# EAGLE design ES_Daisy_Pod_Rev5 (EAGLE 9.6.2)

## Sheet 1 of 2
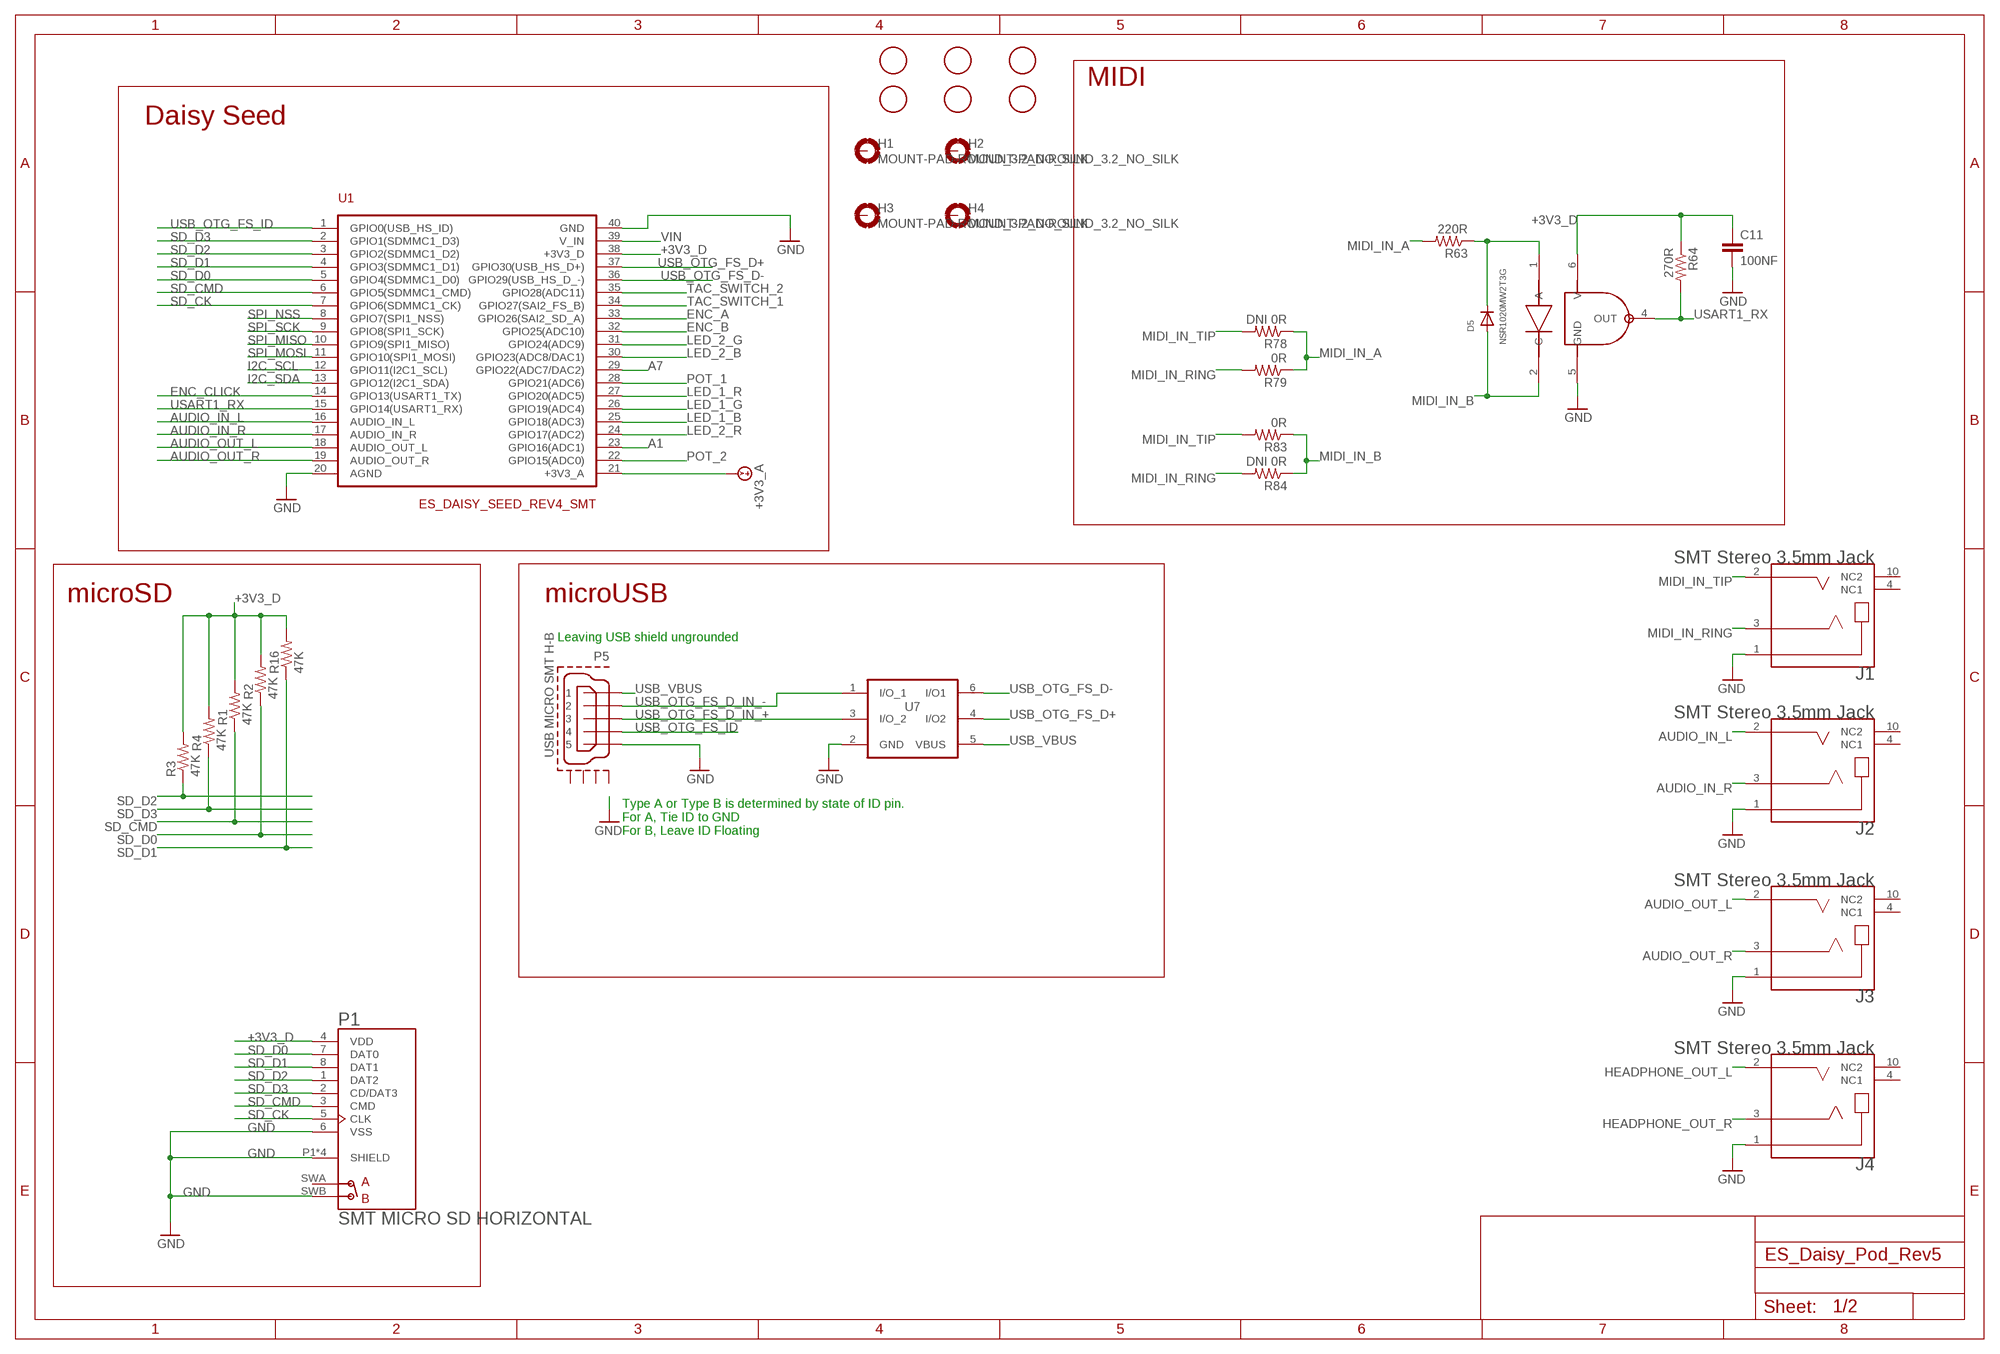
[diagram p0: schematic, sheet 1]

### Parts
C11  100NF  C-EUC0402  [C0402]
D5  NSR1020MW2T3G  DIODE_SOD-323F  [SOD-323F]
FD1  FIDUCIAL  [FIDUCIAL_1MM]
FD2  FIDUCIAL  [FIDUCIAL_1MM]
FD3  FIDUCIAL  [FIDUCIAL_1MM]
FD4  FIDUCIAL  [FIDUCIAL_1MM]
FD5  FIDUCIAL  [FIDUCIAL_1MM]
FD6  FIDUCIAL  [FIDUCIAL_1MM]
H1  MOUNT-PAD-ROUND_3.2_NO_SILK  [32-PAD_NO_SILK]
H2  MOUNT-PAD-ROUND_3.2_NO_SILK  [32-PAD_NO_SILK]
H3  MOUNT-PAD-ROUND_3.2_NO_SILK  [32-PAD_NO_SILK]
H4  MOUNT-PAD-ROUND_3.2_NO_SILK  [32-PAD_NO_SILK]
J1  SMT Stereo 3.5mm Jack  SJ2_TRS_JACK  [CUI_SJ2-35863B1-SMT-TR]
J2  SMT Stereo 3.5mm Jack  SJ2_TRS_JACK  [CUI_SJ2-35863B1-SMT-TR]
J3  SMT Stereo 3.5mm Jack  SJ2_TRS_JACK  [CUI_SJ2-35863B1-SMT-TR]
J4  SMT Stereo 3.5mm Jack  SJ2_TRS_JACK  [CUI_SJ2-35863B1-SMT-TR]
P1  SMT MICRO SD HORIZONTAL  MICRO_SD_RIGHT_ANGLE  [HRS_DM3AT-SF-PEJM5]
P5  USB MICRO SMT H-B  USB_MICRO_AB_CUT2  [47589-0001_CUT2]
R1  47K  R-US_R0603  [R0603]
R2  47K  R-US_R0603  [R0603]
R3  47K  R-US_R0603  [R0603]
R4  47K  R-US_R0603  [R0603]
R16  47K  R-US_R0603  [R0603]
R63  220R  R-US_R0603  [R0603]
R64  270R  R-US_R0603  [R0603]
R78  DNI 0R  R-US_R0603  [R0603]
R79  0R  R-US_R0603  [R0603]
R83  0R  R-US_R0603  [R0603]
R84  DNI 0R  R-US_R0603  [R0603]
U1  ES_DAISY_SEED_REV4_SMT  [ES_DAISY_SEED_SMT]
U7  USBLC6 TVS SOT-23-6  USBLC6-2SC6  [SOT-23-6L]
U15  H11L1SR2M  OPTOISOLATOR_H11L1M  [DIL06_GULLWING]

### Nets
+3V3_A: U1.21(+3V3_A) ; also sheet 2
+3V3_D: C11.1 P1.4(VDD) R1.2 R2.2 R3.2 R4.2 R16.2 R64.1 U1.38(+3V3_D) U15.6(V) ; also sheet 2
A1: U1.23(GPIO16(ADC1)) ; also sheet 2
A7: U1.29(GPIO22(ADC7/DAC2)) ; also sheet 2
AUDIO_IN_L: J2.2(TIP) U1.16(AUDIO_IN_L)
AUDIO_IN_R: J2.3(RING) U1.17(AUDIO_IN_R)
AUDIO_OUT_L: J3.2(TIP) U1.18(AUDIO_OUT_L) ; also sheet 2
AUDIO_OUT_R: J3.3(RING) U1.19(AUDIO_OUT_R) ; also sheet 2
ENC_A: U1.33(GPIO26(SAI2_SD_A)) ; also sheet 2
ENC_B: U1.32(GPIO25(ADC10)) ; also sheet 2
ENC_CLICK: U1.14(GPIO13(USART1_TX)) ; also sheet 2
GND: C11.2 J1.1(SLEEVE) J2.1(SLEEVE) J3.1(SLEEVE) J4.1(SLEEVE) P1.6(VSS) P1.P1(SHIELD) P1.P2(SHIELD) P1.P3(SHIELD) P1.P4(SHIELD) P1.SWB(B) P5.5 U1.20(AGND) U1.40(GND) U7.2(GND) U15.5(GND) ; also sheet 2
HEADPHONE_OUT_L [DATA]: J4.2(TIP) ; also sheet 2
HEADPHONE_OUT_R [DATA]: J4.3(RING) ; also sheet 2
I2C_SCL: U1.12(GPIO11(I2C1_SCL)) ; also sheet 2
I2C_SDA: U1.13(GPIO12(I2C1_SDA)) ; also sheet 2
LED_1_B: U1.25(GPIO18(ADC3)) ; also sheet 2
LED_1_G: U1.26(GPIO19(ADC4)) ; also sheet 2
LED_1_R: U1.27(GPIO20(ADC5)) ; also sheet 2
LED_2_B: U1.30(GPIO23(ADC8/DAC1)) ; also sheet 2
LED_2_G: U1.31(GPIO24(ADC9)) ; also sheet 2
LED_2_R: U1.24(GPIO17(ADC2)) ; also sheet 2
MIDI_IN_A: R63.2 R78.1 R79.1
MIDI_IN_B: D5.A R83.1 R84.1 U15.2(C)
MIDI_IN_RING: J1.3(RING) R79.2 R84.2
MIDI_IN_TIP: J1.2(TIP) R78.2 R83.2
N$77: D5.C R63.1 U15.1(A)
POT_1: U1.28(GPIO21(ADC6)) ; also sheet 2
POT_2: U1.22(GPIO15(ADC0)) ; also sheet 2
SD_CK: P1.5(CLK) U1.7(GPIO6(SDMMC1_CK))
SD_CMD: P1.3(CMD) R1.1 U1.6(GPIO5(SDMMC1_CMD))
SD_D0: P1.7(DAT0) R2.1 U1.5(GPIO4(SDMMC1_D0))
SD_D1: P1.8(DAT1) R16.1 U1.4(GPIO3(SDMMC1_D1))
SD_D2: P1.1(DAT2) R3.1 U1.3(GPIO2(SDMMC1_D2))
SD_D3: P1.2(CD/DAT3) R4.1 U1.2(GPIO1(SDMMC1_D3))
SPI_MISO: U1.10(GPIO9(SPI1_MISO)) ; also sheet 2
SPI_MOSI: U1.11(GPIO10(SPI1_MOSI)) ; also sheet 2
SPI_NSS: U1.8(GPIO7(SPI1_NSS)) ; also sheet 2
SPI_SCK: U1.9(GPIO8(SPI1_SCK)) ; also sheet 2
TAC_SWITCH_1: U1.34(GPIO27(SAI2_FS_B)) ; also sheet 2
TAC_SWITCH_2: U1.35(GPIO28(ADC11)) ; also sheet 2
USART1_RX: R64.2 U1.15(GPIO14(USART1_RX)) U15.4(OUT)
USB_OTG_FS_D+: U1.37(GPIO30(USB_HS_D+)) U7.4(I/O2)
USB_OTG_FS_D-: U1.36(GPIO29(USB_HS_D_-)) U7.6(I/O1)
USB_OTG_FS_D_IN_+ [DATA]: P5.3 U7.3(I/O_2)
USB_OTG_FS_D_IN_- [DATA]: P5.2 U7.1(I/O_1)
USB_OTG_FS_ID: P5.4 U1.1(GPIO0(USB_HS_ID))
USB_VBUS: P5.1 U7.5(VBUS)
VIN: U1.39(V_IN) ; also sheet 2
Unconnected: H1.B3,2(MOUNT) H2.B3,2(MOUNT) H3.B3,2(MOUNT) H4.B3,2(MOUNT) J1.4(NC1) J1.10(NC2) J2.4(NC1) J2.10(NC2) J3.4(NC1) J3.10(NC2) J4.4(NC1) J4.10(NC2) P1.SWA(A) P5.CASING1(GND1) P5.CASING2(GND2) P5.CASING3(GND3) P5.CASING4(GND4)

### Notes on the sheet
- MIDI
- Daisy Seed
- microSD | microUSB
- Leaving USB shield ungrounded
- Type A or Type B is determined by state of ID pin.
  For A, Tie ID to GND
  For B, Leave ID Floating

## Sheet 2 of 2
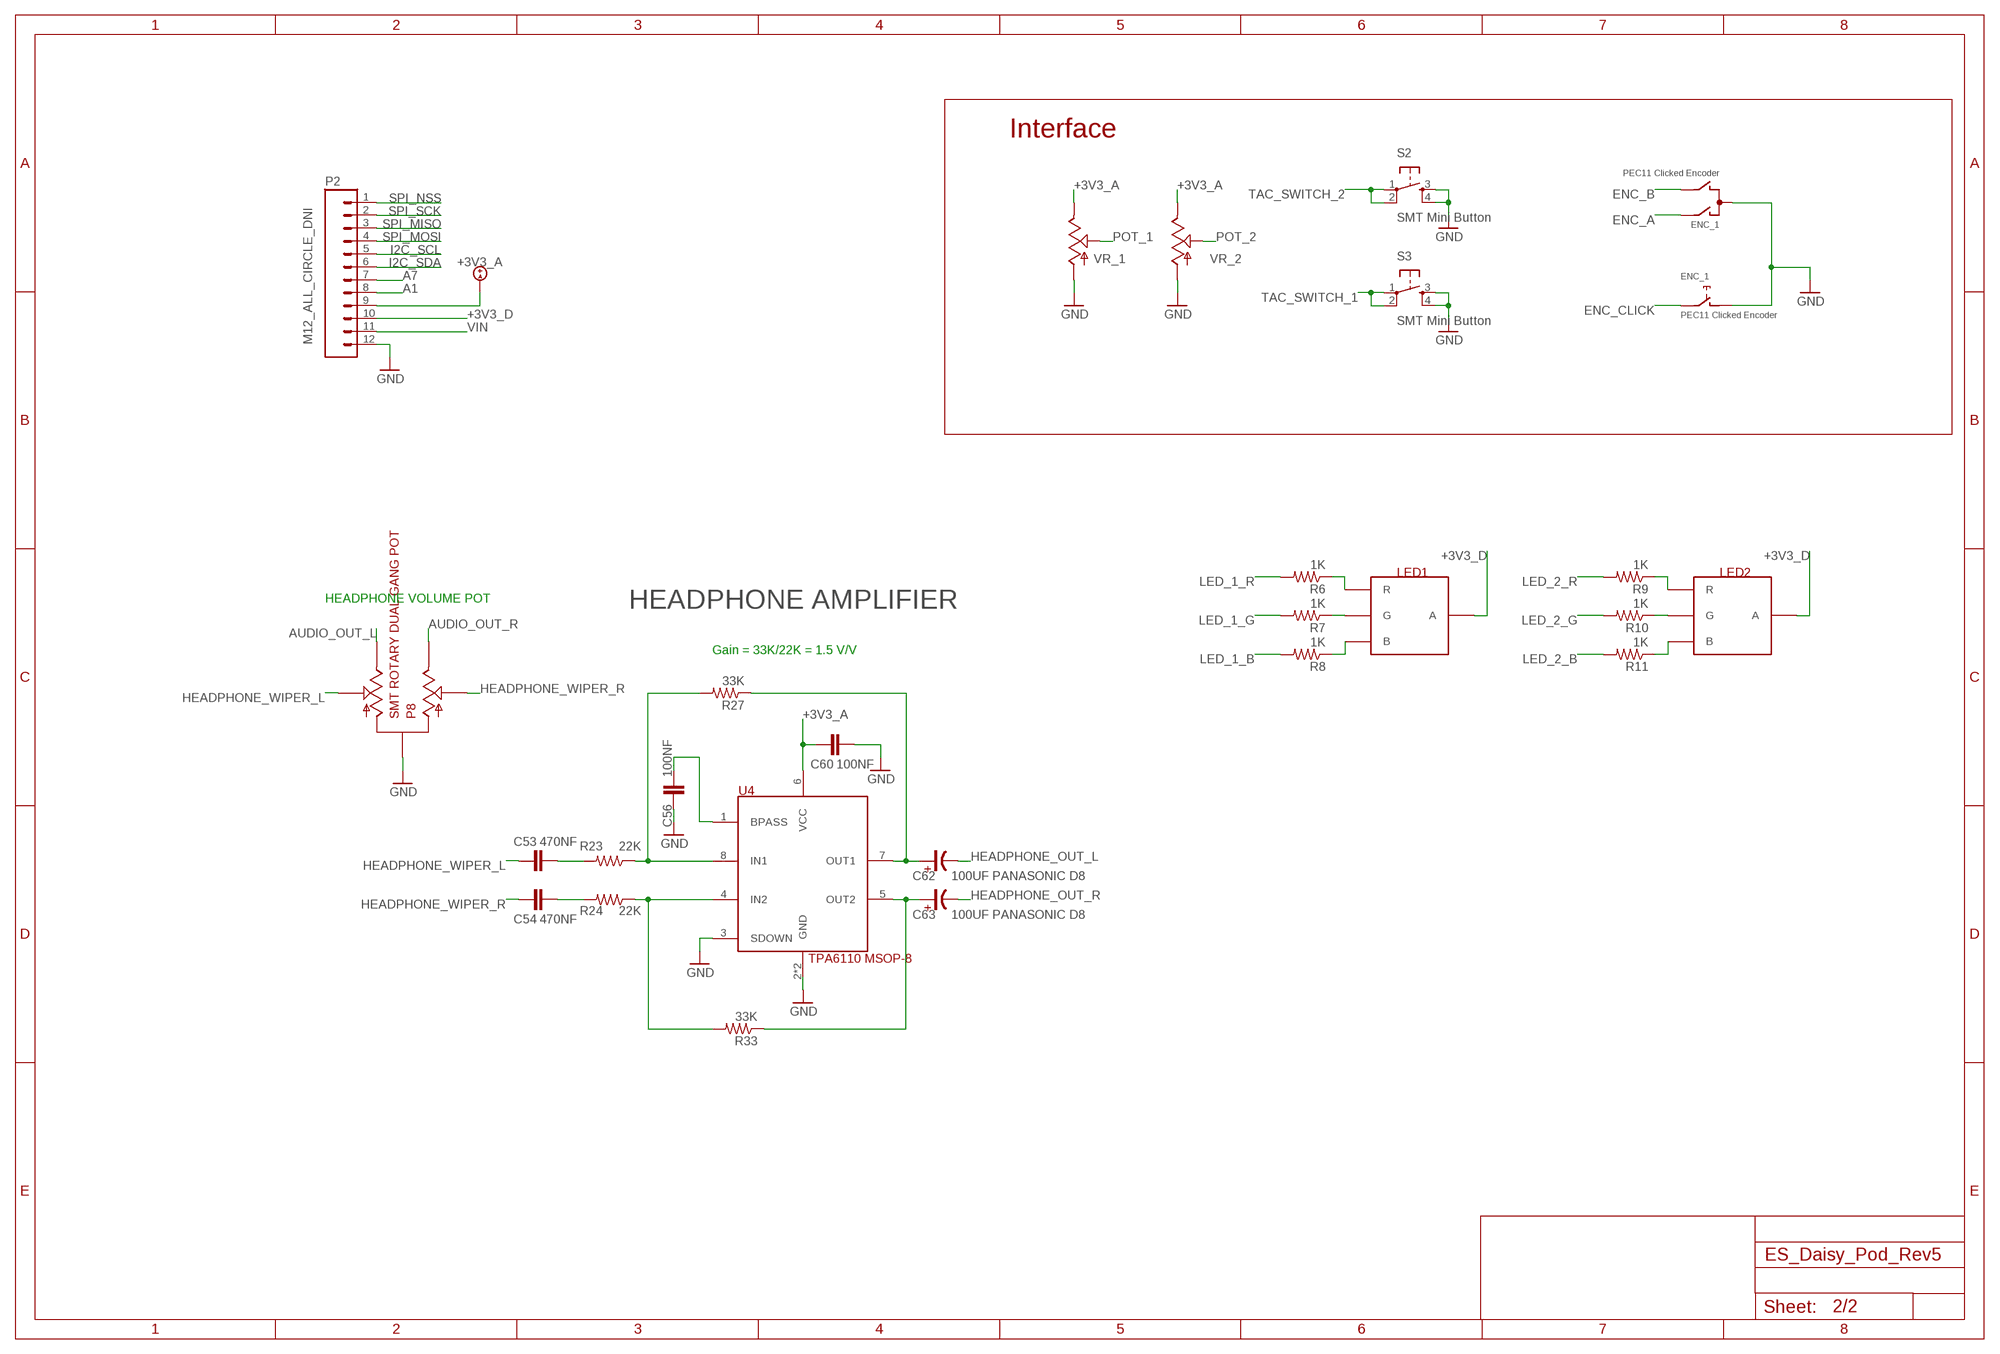
[diagram p1: schematic, sheet 2]

### Parts
C53  470NF  C-EUC0603  [C0603]
C54  470NF  C-EUC0603  [C0603]
C56  100NF  C-EUC0402  [C0402]
C60  100NF  C-EUC0402  [C0402]
C62  100UF PANASONIC D8  C-EU-POL_D  [PANASONIC_D]
C63  100UF PANASONIC D8  C-EU-POL_D  [PANASONIC_D]
ENC_1  PEC11 Clicked Encoder  ENCODER_SMT  [VH1-147]
LED1  RGB LED SMT PLCC4  LED_RGB_SMT  [P-LCC-4-3]
LED2  RGB LED SMT PLCC4  LED_RGB_SMT  [P-LCC-4-3]
P2  M12_ALL_CIRCLE_DNI  M12_ALL_CIRCLE  [1X12_NO_SILK_ALL_CIRCLE]
P8  SMT ROTARY DUAL GANG POT  ROTARY_POT  [RK10J12R0A0B]
R6  1K  R-US_R0402  [R0402]
R7  1K  R-US_R0402  [R0402]
R8  1K  R-US_R0402  [R0402]
R9  1K  R-US_R0402  [R0402]
R10  1K  R-US_R0402  [R0402]
R11  1K  R-US_R0402  [R0402]
R23  22K  R-US_R0603  [R0603]
R24  22K  R-US_R0603  [R0603]
R27  33K  R-US_R0603  [R0603]
R33  33K  R-US_R0603  [R0603]
S2  SMT Mini Button  TAC_SWITCH_SMT  [TL3301SPF160QJ]
S3  SMT Mini Button  TAC_SWITCH_SMT  [TL3301SPF160QJ]
U4  TPA6110 MSOP-8  TPA6110MSOP  [MSOP_8_PWRPAD]
VR_1  P-10K-B-R-PIP  POT_9MM_SNAP-IN__SILK_PIP  [9MM_SNAP-IN_POT_SILK_PIP]
VR_2  P-10K-B-R-PIP  POT_9MM_SNAP-IN__SILK_PIP  [9MM_SNAP-IN_POT_SILK_PIP]

### Nets
+3V3_A: C60.2 P2.9 U4.6(VCC) VR_1.3 VR_2.3 ; also sheet 1
+3V3_D: LED1.2(A) LED2.2(A) P2.10 ; also sheet 1
A1: P2.8 ; also sheet 1
A7: P2.7 ; also sheet 1
AUDIO_OUT_L: P8.P$5 ; also sheet 1
AUDIO_OUT_R: P8.P$4 ; also sheet 1
ENC_A: ENC_1.A ; also sheet 1
ENC_B: ENC_1.B ; also sheet 1
ENC_CLICK: ENC_1.E ; also sheet 1
GND: C56.1 C60.1 ENC_1.C ENC_1.D P2.12 P8.P$1 S2.3 S2.4 S3.3 S3.4 U4.2(GND) U4.3(SDOWN) U4.9(GND) VR_1.1 VR_2.1 ; also sheet 1
HEADPHONE_OUT_L [DATA]: C62.-(NEG) ; also sheet 1
HEADPHONE_OUT_R [DATA]: C63.-(NEG) ; also sheet 1
HEADPHONE_WIPER_L [DATA]: C53.1 P8.P$2
HEADPHONE_WIPER_R [DATA]: C54.1 P8.P$3
I2C_SCL: P2.5 ; also sheet 1
I2C_SDA: P2.6 ; also sheet 1
LED_1_B: R8.2 ; also sheet 1
LED_1_G: R7.2 ; also sheet 1
LED_1_R: R6.2 ; also sheet 1
LED_2_B: R11.2 ; also sheet 1
LED_2_G: R10.2 ; also sheet 1
LED_2_R: R9.2 ; also sheet 1
N$2: LED1.1(R) R6.1
N$3: LED1.4(G) R7.1
N$4: LED1.3(B) R8.1
N$5: LED2.1(R) R9.1
N$6: LED2.4(G) R10.1
N$7: LED2.3(B) R11.1
N$12 [DATA]: C54.2 R24.2
N$19 [DATA]: R23.1 R27.2 U4.8(IN1)
N$20 [DATA]: R24.1 R33.2 U4.4(IN2)
N$34 [DATA]: C53.2 R23.2
N$39 [DATA]: C56.2 U4.1(BPASS)
N$40 [DATA]: C62.+(POS) R27.1 U4.7(OUT1)
N$41 [DATA]: C63.+(POS) R33.1 U4.5(OUT2)
POT_1: VR_1.2 ; also sheet 1
POT_2: VR_2.2 ; also sheet 1
SPI_MISO: P2.3 ; also sheet 1
SPI_MOSI: P2.4 ; also sheet 1
SPI_NSS: P2.1 ; also sheet 1
SPI_SCK: P2.2 ; also sheet 1
TAC_SWITCH_1: S3.1 S3.2 ; also sheet 1
TAC_SWITCH_2: S2.1 S2.2 ; also sheet 1
VIN: P2.11 ; also sheet 1
Unconnected: ENC_1.GND1(G) ENC_1.GND2(G) ENC_1.GND3(G) ENC_1.GND4(G) ENC_1.GND5(G) ENC_1.GND6(G)

### Notes on the sheet
- Interface
- HEADPHONE VOLUME POT
- HEADPHONE AMPLIFIER
- Gain = 33K/22K = 1.5 V/V

## Library data of the parts
C11 C56 C60 = Electrosmith-Passives:C-EU: CAPACITOR, European symbol
C53 C54 = Electrosmith-Passives:C-EU: CAPACITOR, European symbol; PACKAGE: C0603
C62 C63 = Electrosmith-Passives:C-EU-POL
D5 = Electrosmith-Semiconductors:DIODE: Diode SMADIODE - SMA Surface Mount Package 20V 1A Schottky Diode Digikey: 641-1014-6-ND DO-1N4148 - Through Hole Small Current Diode SOD-123 20V 1 A (.5mV Vf) Schottky Diode - Digikey: MBRX120TPMSCT-ND SOD-323 10V 570mA (.38mV Vf, 3ns) Schottky Diode - Digikey: ZLLS410CT-ND SOD-523 30V 30mA Schottky Diode (RB751S-40TE61) - Digikey: RB751S-40TE61CT-ND SOT23-R/W - SOT23 Package (R = Solder Paste/Reflow Ovens, W = Hand-Soldering) BAT54Film 40V 300mA - Digikey: 497-7162-1-ND; PACKAGE: SOD-323
ENC_1 = Electrosmith-Interface:ENCODER: ALPS rotary Encoder EC12E series with switch
FD1-FD6 = Electrosmith-Connectors:FIDUCIAL: For use by pick and place machines to calibrate the vision/machine, 1mm By microbuilder.eu
H1-H4 = Electrosmith-Connectors:MOUNT-PAD-ROUND: MOUNTING PAD, round
J1-J4 = Electrosmith-Connectors:SJ2_TRS_JACK: 3 conductors, 3.5mm, SMT Audio Jack w/ Tip Switch; AVAILABILITY: Unavailable; CUI_PURCHASE_URL: https://www.cui.com/product/interconnect/audio-connectors/jacks/3.5-mm-jacks/sj2-3586x-smt-series?utm_source=snapeda.com&utm_medium=referral&utm_campaign=snapedaBOM; DESCRIPTION: 3 conductors, 3.5mm, SMT Audio Jack w/ Tip Switch; MF: CUI Inc.; MP: SJ2-35863B1-SMT-TR; PACKAGE: None; PRICE: None
LED1 LED2 = Electrosmith-Interface:LED_RGB_SMT; BIN#: 8-001; IPN: RGB LED SMT PLCC4; MPN: CLVBA-FKA-CC1F1L1BB7R3R3; PACKAGE: PLCC4
P1 = Electrosmith-Connectors:MICRO_SD_RIGHT_ANGLE: DM3 Series 8 Position Right Angle SMT Push Push Ejection MicroSD Card Connector; AVAILABILITY: Unavailable; DESCRIPTION: DM3 RA SMT microSD memory card push/push; MF: Hirose; MP: DM3AT-SF-PEJM5; PACKAGE: None; PRICE: None
P2 = Electrosmith-Connectors:M12
P5 = Electrosmith-Connectors:USB_MICRO_AB; IPN: USB MICRO SMT H-B
P8 = Electrosmith-Interface:ROTARY_POT
R1-R4 R16 R23 R24 R27 R33 R63 R64 R78 R79 R83 R84 = Electrosmith-Passives:R-US_: RESISTOR, American symbol; PACKAGE: R0603
R6-R11 = Electrosmith-Passives:R-US_: RESISTOR, American symbol
S2 S3 = Electrosmith-Interface:TAC_SWITCH_SMT: Momentary Switch Button commonly used for reset or general input. Spark Fun Electronics SKU : COM-00097; BIN#: 24-010; IPN: SMT Mini Button; MPN: TL3301SPF160QJ
U1 = Electrosmith-Boards:ES_DAISY_SEED_REV4
U4 = Electrosmith-IC:TPA6110
U7 = Electrosmith-Semiconductors:USBLC6-2: VERY LOW CAPACITANCE ESD PROTECTION 2 line Datasheet link <http://www.st.com/web/catalog/sense_power/FM114/CL1137/SC1489/PF93353>; IPN: USBLC6-2SC6; MPN: USBLC6-2SC6
U15 = Electrosmith-IC:OPTOISOLATOR_H11L1M; MPN: H11L1SR2M
VR_1 VR_2 = Electrosmith-Interface:POT_9MM_SNAP-IN_: 9mm vertical snap-in pot, Alpha / Panasonic style; IPN: P-10K-B-R Pointer PIP

## Net classes
0 DEFAULT: width 0.102 mm, drill 0.2 mm, clearance 0.102 mm
1 POWER: width 0.102 mm, drill 0.2 mm, clearance 0.102 mm

## Board
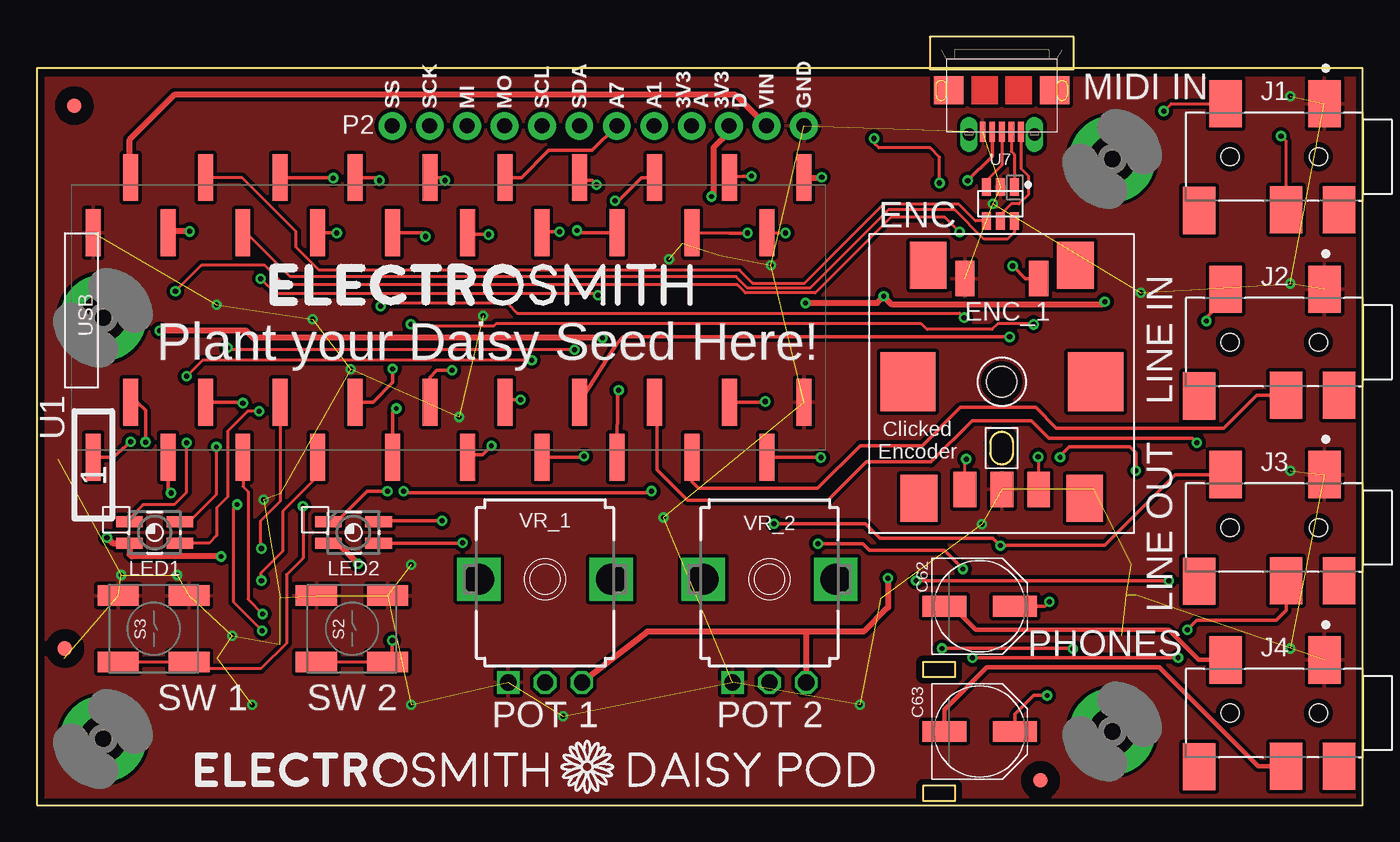
[diagram p2: board, top side]
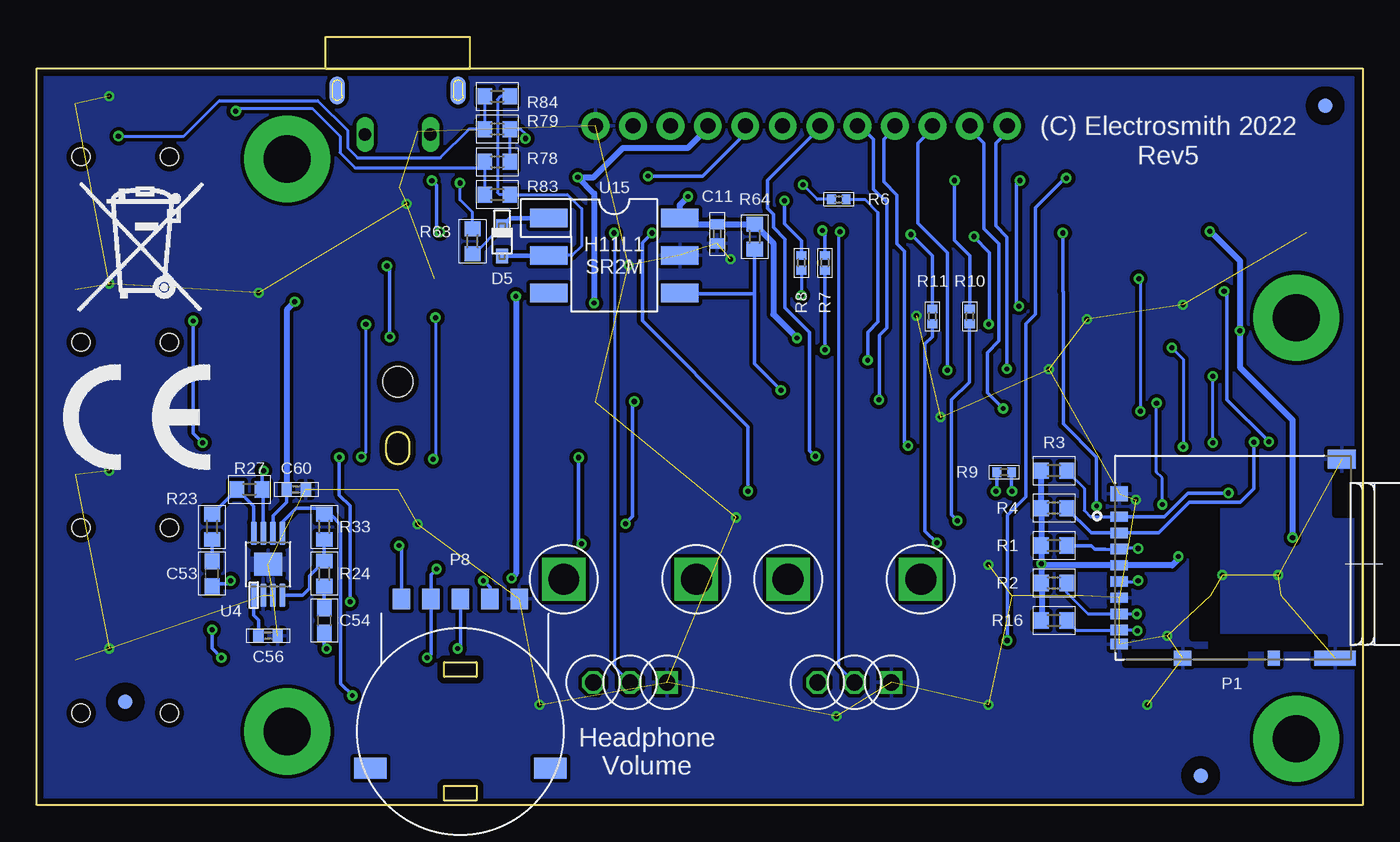
[diagram p3: board, bottom side, seen from below]

Size 90 x 50 mm. Coordinates in mm from the lower left corner, seen from the top.
Outline: 0,50 0,0 90,0 90,50 0,50
Copper layers (1*16): Top 0.0356mm / dielectric 1.5011mm / Bottom 0.0356mm
Design rules "ES_DRC_MaskedVias *": minimum track width 6mil, minimum drill 13mil, track to track 5mil, track to pad 5mil, pad to pad 5mil, via to via 6mil, smd to smd 5mil, copper to edge 15mil, drill to drill 6mil, minimum pad ring 5mil, minimum via ring 7mil, stop-mask expansion 3mil, vias tented up to drill 16mil, thermal gap 10mil

### Footprints (pad centres in the part's own frame; a part is rotated, then mirrored left to right if it is on the bottom)
C0402 = smd 0.7 x 0.9: 1 -0.65,0; 2 0.65,0
C0603 = smd 1.1 x 1: 1 -0.85,0; 2 0.85,0
PANASONIC_D = smd 3 x 1.4: + 2.4,0; - -2.4,0
SOD-323F = smd 1 x 0.8: A 1,0; C -1,0
VH1-147 = smd 1.55 x 2.4: A -2.5,-7.3; B 2.5,-7.3; C 0,-7.3 | smd 1.3 x 2.4: D -2.5,7; E 2.5,7 | smd 3.75 x 4: GND1 -6.375,0; GND2 6.375,0 | smd 2.5 x 3.2: GND3 -5.625,-7.9; GND4 5.625,-7.9; GND5 -5,7.9; GND6 5,7.9 | hole 2.05: 0,0
FIDUCIAL_1MM = smd 1 x 1: 1 0,0
32-PAD_NO_SILK = drill 3.2 pad 5.842: B3,2 0,0
CUI_SJ2-35863B1-SMT-TR = smd 2.2 x 3.2: 1 -3.4,-3.6; 2 3.3,-3.6; 3 -0.8,3.6; 4 -4.4,3.6; 10 5.1,3.65 | hole 1.2: -3,0; 3,0
P-LCC-4-3 = smd 1.8 x 0.75: 1 -1.7,0.725; 2 -1.7,-0.725; 3 1.7,-0.725; 4 1.7,0.725
HRS_DM3AT-SF-PEJM5 = smd 0.7 x 1.2: 1 2.775,7.725; 2 1.675,7.725; 3 0.575,7.725; 4 -0.525,7.725; 5 -1.625,7.725; 6 -2.725,7.725; 7 -3.825,7.725; 8 -4.925,7.725; SWB -5.875,7.725 | smd 1 x 1.2: P1 -6.825,3.425; P4 4.325,7.725 | smd 1 x 2.8: P2 -6.825,-6.925 | smd 1.3 x 1.9: P3 6.675,-7.375 | smd 1 x 0.8: SWA -6.825,-2.775
1X12_NO_SILK_ALL_CIRCLE = drill 1.016 pad 1.88: 1 0,0; 2 2.54,0; 3 5.08,0; 4 7.62,0; 5 10.16,0; 6 12.7,0; 7 15.24,0; 8 17.78,0; 9 20.32,0; 10 22.86,0; 11 25.4,0; 12 27.94,0
47589-0001_CUT2 = smd 1.35 x 0.4: 1 2.8,1.3; 2 2.8,0.65; 3 2.8,0; 4 2.8,-0.65; 5 2.8,-1.3 | smd 1.9 x 2: CASING1 0,3.6; CASING2 0,-3.6 | drill 0.85 pad 0.965 long: CASING3 3,2.225; CASING4 3,-2.225 | smd 1.93 x 1.067 bottom: P$1 0,-4.107; P$2 0,4.107
RK10J12R0A0B = smd 1.2 x 1.4: P$1 -4,-9; P$2 -2,-9; P$3 0,-9; P$4 2,-9; P$5 4,-9 | smd 2.2 x 1.4: P$6 -6.1,2.5; P$7 6.1,2.5
R0603 = smd 1 x 1.1: 1 -0.85,0; 2 0.85,0
R0402 = smd 0.6 x 0.7: 1 -0.5,0; 2 0.5,0
TL3301SPF160QJ = smd 2.794 x 1.397: 1 -2.413,-2.248; 2 2.413,-2.248; 3 -2.413,2.248; 4 2.413,2.248
ES_DAISY_SEED_SMT = smd 3.175 x 1.016: 1 -9.493,24.13; 2 -5.747,21.59; 3 -9.493,19.05; 4 -5.747,16.51; 5 -9.493,13.97; 6 -5.747,11.43; 7 -9.493,8.89; 8 -5.747,6.35; 9 -9.493,3.81; 10 -5.747,1.27; 11 -9.493,-1.27; 12 -5.747,-3.81; 13 -9.493,-6.35; 14 -5.747,-8.89; 15 -9.493,-11.43; 16 -5.747,-13.97; 17 -9.493,-16.51; 18 -5.747,-19.05; 19 -9.493,-21.59; 20 -5.747,-24.13; 21 9.493,-24.13; 22 5.747,-21.59; 23 9.493,-19.05; 24 5.747,-16.51; 25 9.493,-13.97; 26 5.747,-11.43; 27 9.493,-8.89; 28 5.747,-6.35; 29 9.493,-3.81; 30 5.747,-1.27; 31 9.493,1.27; 32 5.747,3.81; 33 9.493,6.35; 34 5.747,8.89; 35 9.493,11.43; 36 5.747,13.97; 37 9.493,16.51; 38 5.747,19.05; 39 9.493,21.59; 40 5.747,24.13
MSOP_8_PWRPAD = smd 1.6 x 0.4: 1 -2.095,0.975; 2 -2.095,0.325; 3 -2.095,-0.325; 4 -2.095,-0.975; 5 2.095,-0.975; 6 2.095,-0.325; 7 2.095,0.325; 8 2.095,0.975 | smd 1.57 x 1.89: 9 0,0
SOT-23-6L = smd 0.6 x 1.2: 1 -0.95,-1.15; 2 0,-1.15; 3 0.95,-1.15; 4 0.95,1.15; 5 0,1.15; 6 -0.95,1.15
DIL06_GULLWING = smd 1.27 x 2.54: 1 -2.54,-4.445; 2 0,-4.445; 3 2.54,-4.445; 4 2.54,4.445; 5 0,4.445; 6 -2.54,4.445
9MM_SNAP-IN_POT_SILK_PIP = drill 1.1 square: 1 -2.5,-7 | drill 1.1 octagon: 2 0,-7; 3 2.5,-7 | drill 2.1 square: CHASSIS1 -4.5,0; CHASSIS2 4.5,0

### Placement (x,y rotation side)
C11  43.81,38.77 270 bottom
C53  78.11,15.71 90 bottom
C54  70.48,12.53 90 bottom
C56  74.3,11.5 180 bottom
C60  72.39,21.43 180 bottom
C62  64,13.5 0 top
C63  64,5 0 top
D5  58.42,38.27 270 bottom
ENC_1  65.5,28.73 0 top
FD1  1.91,10.63 0 top
FD2  2.54,47.46 0 top
FD3  68.13,1.67 0 top
FD4  2.54,47.46 0 bottom
FD5  11,2 0 bottom
FD6  84,7 0 bottom
H1  4.5,33.07 0 top
H2  4.5,4.5 0 top
H3  73,43.84 0 top
H4  73,5 0 top
J1  84,44 180 top
J2  84,31.42 180 top
J3  84,18.83 180 top
J4  84,6.25 180 top
LED1  8,18.5 0 top
LED2  21.5,18.5 0 top
P1  8.8,16.8 90 bottom
P2  24.13,46.09 0 top
P5  65.5,48.5 270 top
P8  61.25,5 180 bottom
R1  20.95,17.62 180 bottom
R2  20.95,15.08 180 bottom
R3  20.95,22.7 180 bottom
R4  20.95,20.16 180 bottom
R6  35.56,41.11 180 bottom
R7  36.5,36.8 90 bottom
R8  38.1,36.8 90 bottom
R9  24.33,22.59 180 bottom
R10  26.67,33.17 90 bottom
R11  29.21,33.17 90 bottom
R16  20.95,12.53 180 bottom
R23  78.11,18.89 270 bottom
R24  70.48,15.71 270 bottom
R27  75.56,21.43 180 bottom
R33  70.48,18.89 270 bottom
R63  60.42,38.27 90 bottom
R64  41.27,38.57 270 bottom
R78  58.74,43.65 180 bottom
R79  58.74,45.87 180 bottom
R83  58.74,41.43 180 bottom
R84  58.74,48.09 180 bottom
S2  21.39,11.97 0 top
S3  7.93,11.97 0 top
U1  27.96,33.09 90 top
U4  74.3,16.34 90 bottom
U7  65.41,40.79 180 top
U15  50.8,37.3 270 bottom
U$2  [TONNE_9X13MM]  87.63,32.86 0 bottom
U$3  [CE_10X7.3MM]  88.27,22.7 0 bottom
U$4  [DAISY_POD_BRANDING_2]  34.25,2.5 0 top
U$7  [ES_TEXT_3X30MM]  30.1,35.23 0 top
VR_1  34.5,15.33 0 top
VR_2  49.73,15.33 0 top

### Tracks (layer width: path | path; a pad name or v marks a point on that pad's centre or on a via)
+3V3_A  (via drill 0.33, 0.35)
  Top 0.406: v57.78,15.41 57.78,13.42 56.14,11.78 52.2,11.78 | v52.17,34.07 57.03,34.07 v57.48,34.53 58.05,33.96 72.29,33.96 v72.49,34.16 | U1.21 53.26,42.59 v53.28,42.6 | VR_1.3 41.45,11.78 52.2,11.78 | VR_2.3 52.23,11.75 52.2,11.78
  Bottom 0.254: U4.6 73.97,19.63 73.04,20.56 C60.2
  Bottom 0.406: v57.78,15.41 57.48,15.7 v57.48,34.53 | v52.17,34.07 52.17,41.5 v53.28,42.6 52.21,42.6 50.21,44.6 45.8,44.6 44.45,45.95 P2.9 | v72.49,34.16 73.04,33.61 C60.2
+3V3_D  (via drill 0.33, 0.35)
  Top 0.406: v12.52,16.87 6.45,16.87 6.3,17.02 LED1.2 5.14,17.77 v4.76,18.16 | v21.8,16.38 20.41,17.77 LED2.2 | U1.38 8.99,38.92 9.38,38.94 v10.38,38.94 | P2.10 46.99,45.68 45.94,44.63 45.94,41.45 v45.79,41.3 | v38.4,31.7 14.7,31.7 14.2,32.2 v8.34,32.2
  Bottom 0.254: 21.8,17.3 R1.2 v21.8,16.38
  Bottom 0.406: R3.2 R4.2 v21.8,16.38 | v4.76,18.16 4.76,26.14 8.34,29.71 v8.34,32.2 8.34,36.94 10.34,38.94 v10.38,38.94 | 21.8,17.3 21.8,16.3 | 21.8,16.3 R2.2 21.8,14.79 21.74,14.73 21.74,12.88 21.8,12.82 R16.2 | v12.52,16.87 12.52,16.68 12.93,16.27 P1.4 21.78,16.27 21.8,16.3 | v45.79,41.3 46.35,40.73 U15.6 45.94,39.42 C11.1 R64.1 40,38.14 40,33.3 v38.4,31.7
A1  (via drill 0.33)
  Top 0.254: U1.23 47.08,42.65 47.93,42.69 v48.5,42.69
  Bottom 0.254: v48.5,42.69 44.81,42.69 41.8,45.7 41.8,45.98 P2.8
A7
  Top 0.203: 34.71,44.39 34.72,44.4
  Top 0.254: U1.29 32.91,42.59 34.71,44.39 | 34.72,44.4 34.75,44.43 37.7,44.43 P2.7
AUDIO_IN_L  (via drill 0.33)
  Top 0.254: v79.38,32.86 79.38,33.06 80.7,34.38 J2.2 | v78.74,24.6 78.43,24.91 68.69,24.91 67.5,26.1 63.5,26.1 60.7,23.3 56.3,23.3 53.7,20.7 44.16,20.7 42.09,22.77 42.09,27.34 U1.16
  Bottom 0.254: v78.74,24.6 79.38,25.23 v79.38,32.86
AUDIO_IN_R
  Top 0.254: J2.3 82.8,27.82 80.57,25.58 69.22,25.58 67.8,27 62.7,27 60.1,24.4 55.9,24.4 53,21.5 44.9,21.5 44.47,21.93 U1.17
AUDIO_OUT_L  (via drill 0.33, 0.35)
  Top 0.254: J3.2 77.29,22.43 72.49,17.63 65.42,17.63 v65.41,17.62 64.91,18.11 57.22,18.11 56.25,19.09 v50.05,19.09 | v49.45,27.39 49.41,27.35 U1.18
  Bottom 0.254: P8.P$5 65.25,17.46 v65.41,17.62 | v50.05,19.09 49.55,19.59 49.55,27.28 v49.45,27.39
AUDIO_OUT_R  (via drill 0.33, 0.35)
  Top 0.254: v63.5,9.99 v77.47,9.99 | v78.11,11.9 78.74,12.53 84.12,12.53 84.8,13.22 J3.3 | v62.87,16.03 61.59,17.3 56.52,17.3 56.06,17.75 v53.02,17.75 | U1.19 53.2,23.6 v53.22,23.59
  Bottom 0.254: v63.5,9.99 63.25,10.24 P8.P$4 63.25,15.64 v62.87,16.03 | v77.47,9.99 78.11,10.63 v78.11,11.9 | v53.02,17.75 53.22,17.95 v53.22,23.59
ENC_A  (via drill 0.33, 0.35)
  Top 0.203: v23.34,33.86 23.53,34.05 31.95,34.05 32.6,33.39 62.63,33.39 v62.94,33.08 | ENC_1.A 63,23.39 v63.09,23.48
  Top 0.254: U1.33 23.07,42.59 v23.26,42.39
  Bottom 0.203: v62.94,33.08 62.94,23.64 v63.09,23.48
  Bottom 0.254: v23.34,33.86 23.5,34.02 23.5,42.16 v23.26,42.39
ENC_B  (via drill 0.33, 0.35)
  Top 0.203: v25.39,32.62 25.51,32.5 31,32.5 31.17,32.67 60.05,32.67 60.43,32.28 64.84,32.28 65.23,32.67 67.63,32.67 v67.67,32.63 | v67.97,23.64 67.97,21.46 ENC_1.B
  Top 0.254: v26.39,38.59 26.16,38.84 U1.32
  Bottom 0.203: v67.67,32.63 67.67,23.94 v67.97,23.64
  Bottom 0.254: v26.39,38.59 26.39,38.55 25.33,37.5 25.33,32.68 v25.39,32.62
ENC_CLICK  (via drill 0.35)
  Top 0.254: v66.04,31.77 39.8,31.77 39.39,31.36 U1.14 | ENC_1.E 67.1,35.73 v66.24,36.59
  Bottom 0.254: v66.24,36.59 66.04,36.39 v66.04,31.77
GND  (via drill 0.33)  (54 unrouted)
  other vias: 49.83,36.63 18.72,32.97 30.3,33.2 42.91,37.04 5.71,15.62 9.53,15.62 25.4,16.32 14.61,6.82 25.4,6.82 35.72,6.03 15.39,20.72 55.88,6.82 64.17,19.05 42.55,19.52 74.93,34.76 85.09,35.39 85.09,48.09 85.09,22.7 85.09,10.63 12.2,33.97 28.67,26.34 21.3,29.58 13.25,11.5 64.9,40.8
  pour Bottom (isolate 0.254): 0.64,49.37 89.53,49.37 89.53,0.47 0.64,0.47
  pour Top (isolate 0.254): 0.64,49.37 89.53,49.37 89.53,0.47 0.64,0.47
  pour Bottom (isolate 0.254, no thermals): 75.56,16.82 73.03,16.82 72.71,17.14 72.71,19.2 72.39,19.52 71.75,19.52 71.44,19.2 71.44,16.34 71.91,15.87 77.31,15.87 77.31,19.2 76.99,19.52 76.2,19.52 75.88,19.2 75.88,17.14
HEADPHONE_OUT_L
  Top 0.305: J4.2 78.89,9.85 76.83,11.9 63.73,11.9 62.13,13.5 C62.-
HEADPHONE_OUT_R
  Top 0.305: J4.3 82.91,2.65 76.2,9.36 64.5,9.36 61.6,6.47 C63.-
HEADPHONE_WIPER_L  (via drill 0.33)
  Top 0.254: v76.83,15.23 v59.69,15.23
  Bottom 0.254: C53.1 77.95,15.02 77.05,15.02 v76.83,15.23 | v59.69,15.23 59.25,14.79 P8.P$2
HEADPHONE_WIPER_R  (via drill 0.33)
  Top 0.254: v70.33,10.62 70.31,10.63 v61.44,10.63
  Bottom 0.254: P8.P$3 61.25,10.82 v61.44,10.63 | C54.1 70.48,10.78 v70.33,10.62
I2C_SCL  (via drill 0.33)
  Top 0.254: v32.84,27.5 31.92,27.5 U1.12
  Bottom 0.254: v32.84,27.5 32.8,27.54 32.8,31.9 32.3,32.4 32.3,40.9 33.2,41.8 33.2,45.2 34.19,46.19 P2.5
I2C_SDA  (via drill 0.33)
  Top 0.254: U1.13 37.09,23.6 v37.16,23.67
  Bottom 0.254: v37.16,23.67 37.55,24.06 37.55,32.1 39.2,33.75 39.2,38.4 40,39.2 40,40.1 40.4,40.5 40.4,42.4 36.83,45.97 P2.6
LED_1_B  (via drill 0.33)
  Top 0.254: v39.25,41.01 39.49,41.01 41.06,42.59 U1.25
  Bottom 0.254: R8.2 38.1,38.3 39.25,39.45 v39.25,41.01
LED_1_G  (via drill 0.33)
  Top 0.254: U1.26 36.83,38.84 v36.68,38.99
  Bottom 0.254: v36.68,38.99 36.5,38.81 R7.2
LED_1_R  (via drill 0.33)
  Top 0.254: U1.27 36.98,42.46 37.26,42.41 37.7,42.41 v38,42.1
  Bottom 0.203: R6.2 37.01,41.11 v38,42.1
LED_2_B  (via drill 0.35)
  Top 0.254: U1.30 29.33,38.74 29.67,38.72 v30.67,38.72
  Bottom 0.254: R11.2 29.21,37.27 v30.67,38.72
LED_2_G  (via drill 0.35)
  Top 0.254: v27.71,42.39 27.48,42.59 U1.31
  Bottom 0.254: v27.71,42.39 27.71,38.32 26.67,37.28 R10.2
LED_2_R  (via drill 0.33, 0.35)
  Top 0.254: v41.73,21.31 41.61,21.2 25,21.2 v24.9,21.3 | U1.24 47.03,38.82 v48.24,38.82
  Bottom 0.254: v41.73,21.31 41.73,25.69 48.9,32.86 48.9,38.17 v48.24,38.82 | R9.2 24.83,21.36 v24.9,21.3
MIDI_IN_A  (via drill 0.35)
  Top 0.203: v61.28,42.22 61.28,43.97 60.64,44.6 57.15,44.6 56.83,44.92 v56.83,45.24
  Bottom 0.203: R78.1 R79.1 57.15,45.87 56.83,45.55 v56.83,45.24 | R63.2 60.42,40.22 61.28,41.07 v61.28,42.22
MIDI_IN_B
  Bottom 0.203: R84.1 58.52,48.09 58.74,47.88 58.74,41.56 58.6,41.43 R83.1 53.98,41.43 53.02,40.48 53.02,37.94 53.66,37.3 U15.2
  Bottom 0.305: U15.2 55.27,37.27 D5.A
MIDI_IN_RING  (via drill 0.35)
  Top 0.203: J1.3 84.8,45.05 v84.45,45.4
  Bottom 0.203: R84.2 R79.2 60.67,45.87 62.61,43.93 68.23,43.93 68.9,44.6 68.9,45.79 70.92,47.81 77.61,47.81 80.03,45.4 v84.45,45.4
MIDI_IN_TIP  (via drill 0.35)
  Top 0.203: v76.49,47.1 77,47.6 J1.2
  Bottom 0.203: R83.2 R78.2 59.59,43.25 68.4,43.25 69.43,44.27 69.43,45.4 71.3,47.27 76.32,47.27 v76.49,47.1
N$2  (via drill 0.33)
  Top 0.203: LED1.1 6.3,19.48 7.21,20.39 9.32,20.39 10.16,21.23 v10.16,24.6 | v33.6,30.2 11.26,30.2 v10.16,29.1
  Bottom 0.203: v10.16,24.6 v10.16,29.1 | R6.1 34.7,41.1 33.8,41.1 32.9,40.2
  Bottom 0.254: v33.6,30.2 33.6,32.1 32.9,32.8 32.9,40.2
N$3  (via drill 0.33)
  Top 0.203: LED1.4 10.35,19.23 12.19,21.06 v12.19,24.31 | v12.96,31.04 13.09,30.9 v36.5,30.9
  Bottom 0.203: v12.96,31.04 12.19,30.26 v12.19,24.31
  Bottom 0.254: R7.1 v36.5,30.9
N$4  (via drill 0.33)
  Top 0.203: v15.2,35.73 16.2,34.73 37.97,34.73 v38.1,34.6 | v15.09,26.73 14.33,26.73 12.95,25.36 12.95,20.91 12.22,20.18 12.22,18.31 11.69,17.77 LED1.3
  Bottom 0.203: v15.2,35.73 15.09,35.62 v15.09,26.73 | R8.1 v38.1,34.6
N$5  (via drill 0.35)
  Top 0.254: v23.8,21.3 22.43,21.3 20.35,19.23 LED2.1
  Bottom 0.254: R9.1 23.83,21.33 v23.8,21.3
N$6  (via drill 0.33)
  Top 0.254: v27.5,19.3 23.27,19.3 LED2.4
  Bottom 0.254: v27.5,19.3 27.9,19.7 27.9,27.5 26.7,28.7 26.7,32.64 R10.1
N$7  (via drill 0.33)
  Top 0.254: v28.9,17.8 28.88,17.77 LED2.3
  Bottom 0.254: v28.9,17.8 29.7,18.6 29.7,31.3 29.21,31.79 R11.1
N$12
  Bottom 0.254: C54.2 R24.2
N$19
  Bottom 0.254: U4.8 75.27,20.28 R27.2 R23.1
N$20
  Bottom 0.254: R33.2 R24.1 71.47,15.57 71.47,14.72 71.94,14.25 U4.4
N$34
  Bottom 0.254: R23.2 C53.2
N$39
  Bottom 0.254: U4.1 75.27,12.87 74.95,12.55 C56.2
N$40  (via drill 0.33)
  Top 0.254: C62.+ 68.43,13.5 v68.74,13.8 | v69.47,23.61 69.47,23.71 70.08,24.32 74.21,24.32 74.61,23.91 v74.61,22.7
  Bottom 0.254: U4.7 74.62,21.33 R27.1 74.72,22.59 v74.61,22.7 | v68.74,13.8 68.74,20.31 69.47,21.04 v69.47,23.61
N$41  (via drill 0.33)
  Top 0.254: C63.+ 66.4,6.16 67.68,7.44 v68.58,7.44
  Bottom 0.254: U4.5 73.32,19.23 72.39,20.16 70.91,20.16 R33.1 70.06,19.73 69.37,19.04 69.37,8.24 v68.58,7.44
N$77
  Bottom 0.203: R63.1 60.29,37.42 58.44,39.27 D5.C
  Bottom 0.305: U15.1 57.85,39.84 D5.C
POT_1  (via drill 0.35)
  Top 0.254: U1.28 34.38,38.91 v35.48,38.91
  Bottom 0.203: 35.56,38.91 35.56,9.38 VR_1.2
  Bottom 0.254: 35.56,38.91 v35.48,38.91
POT_2  (via drill 0.35)
  Top 0.203: U1.22 50.84,38.84 v50.82,38.82
  Bottom 0.203: v50.82,38.82 50.8,38.8 50.8,9.4 VR_2.2
SD_CK  (via drill 0.35)
  Top 0.203: U1.7 19.07,22.32 16.69,19.94 16.69,17.23 15.24,15.78 v15.24,15.23
  Bottom 0.203: P1.5 15.3,15.17 v15.24,15.23
SD_CMD  (via drill 0.35)
  Top 0.2: 16.53,20.63 15.16,19.26 15.16,17.49 v15.24,17.41
  Top 0.203: U1.6 16.53,20.63
  Bottom 0.203: 17.46,17.38 P1.3 16.44,17.46 15.24,17.46 v15.24,17.41
  Bottom 0.254: 17.46,17.38 18.18,17.38 18.41,17.62 R1.1
SD_D0  (via drill 0.33)
  Top 0.203: v15.34,12.97 14.33,13.98 14.33,21.28 13.99,21.62 U1.5
  Bottom 0.203: R2.1 20.11,14.44 18.64,12.98 P1.7 v15.35,12.98 v15.34,12.97
SD_D1  (via drill 0.33, 0.35)
  Top 0.203: v15.3,11.84 13.38,13.76 13.38,20.18 v13.6,20.4
  Top 0.254: v13.99,27.28 13.91,27.35 U1.4
  Bottom 0.203: R16.1 19.45,11.88 P1.8 15.35,11.88 v15.3,11.84 | v13.6,20.4 13.6,22.2 14,22.6 14,27.27 v13.99,27.28
SD_D2  (via drill 0.35)
  Top 0.254: v9.11,21.18 8.91,21.38 U1.3
  Bottom 0.203: R3.1 18.9,21.49 18.9,20 18.48,19.57 P1.1
  Bottom 0.254: P1.1 13.46,19.57 11.86,21.18 v9.11,21.18
SD_D3  (via drill 0.35)
  Top 0.254: v7.39,24.64 7.39,26.79 6.83,27.35 U1.2
  Bottom 0.254: R4.1 18.43,18.48 P1.2 13.85,18.48 11.77,20.55 8.31,20.55 7.39,21.47 v7.39,24.64
SPI_MISO  (via drill 0.33)
  Top 0.254: U1.10 26.69,29.04 27.15,29.5 v28.2,29.5
  Bottom 0.254: v28.2,29.5 28.2,37.5 30.2,39.5 30.2,44.9 29.2,45.9 29.2,46.09 P2.3
SPI_MOSI  (via drill 0.33)
  Top 0.254: v30.86,24.38 30.25,23.77 29.23,23.77 U1.11
  Bottom 0.254: v30.86,24.38 31.1,24.62 31.1,37.6 31.6,38.1 31.6,41.4 32.5,42.3 32.5,45.2 31.75,45.95 P2.4
SPI_NSS  (via drill 0.33)
  Top 0.254: U1.8 22.81,27.35 24.15,28.69 v24.15,29.6
  Bottom 0.254: v24.15,29.6 24.15,38.55 24.9,39.3 24.9,44.9 24.13,45.67 P2.1
SPI_SCK  (via drill 0.33)
  Top 0.254: U1.9 24.15,26.66 v24.4,26.91
  Bottom 0.254: v24.4,26.91 25.49,28 25.49,30.71 24.7,31.5 24.7,38.1 25.7,39.1 25.7,44.9 26.67,45.87 P2.2
TAC_SWITCH_1  (via drill 0.33, 0.35)
  Top 0.203: S3.1 S3.2 10.8,9.27 15.21,9.27 16.95,11 16.95,15.65 18.06,16.77 v18.06,20.3
  Top 0.254: U1.34 20.34,38.84 v20.36,38.82
  Bottom 0.254: v18.06,20.3 18.06,23.61 20.32,25.87 20.32,34.85 20.36,34.89 v20.36,38.82
TAC_SWITCH_2  (via drill 0.35)
  Top 0.203: S2.1 S2.2
  Top 0.254: v24.13,11.17 24.13,10.05 S2.2 | U1.35 20.08,42.59 v20.12,42.55
  Bottom 0.254: v20.12,42.55 20.22,42.55 22.23,40.54 22.23,33.31 22.86,32.67 22.86,20.94 24.13,19.67 v24.13,11.17
USART1_RX  (via drill 0.35)
  Top 0.254: v39.49,28.16 39.4,28.07 U1.15 | U1.15
  Bottom 0.254: 41.27,34.7 41.27,29.94 v39.49,28.16 | 41.27,34.7 R64.2 | U15.4 46.3,34.7 41.27,34.7
USB_OTG_FS_D+
  Top 0.203: U7.4 63.72,39.64 62.56,40.8 57.5,40.8 52.12,35.42 48.59,35.42 47.7,36.31 19.16,36.31 17.6,37.87 17.6,38.91 13.93,42.59 U1.37
USB_OTG_FS_D-
  Top 0.203: U7.6 66.36,38.88 65.88,38.41 64.3,38.41 62.3,40.4 57.8,40.4 52.49,35.09 48.23,35.09 47.46,35.86 17.19,35.86 14.2,38.84 U1.36
USB_OTG_FS_D_IN_+
  Top 0.203: P5.3 65.5,43.43 64.45,42.38 U7.3
USB_OTG_FS_D_IN_-
  Top 0.203: P5.2 66.15,44.37 66.36,44.16 U7.1
USB_OTG_FS_ID  (via drill 0.35)
  Top 0.203: v62.64,38.91 61.64,39.9 57.99,39.9 52.85,34.76 48.09,34.76 47.55,35.3 16.8,35.3 15.48,36.62 11.16,36.62 v9.41,34.87
  Top 0.254: P5.4 64.85,44.05 v63.18,42.38 | v6.37,24.66 5.19,23.6 U1.1
  Bottom 0.254: v62.64,38.91 62.87,39.13 62.87,42.06 v63.18,42.38 | v9.41,34.87 9.21,34.67 9.21,27.52 6.37,24.69 v6.37,24.66
USB_VBUS
  Top 0.203: P5.1 66.8,43.21 67.31,42.7 67.31,41.43 66.67,40.79 66.14,40.79 65.41,40.06 U7.5
VIN
  Top 0.406: P2.11 47.42,48.2 9.33,48.2 6.31,45.17 6.32,42.64 U1.39

### Text on the board
tPlace: MIDI IN | SS | SCK | MI | MO | SCL | SDA | A7 | A1 | 3V3 | A | 3V3 | D | VIN | GND | ENC | LINE IN | Plant your Daisy Seed Here! | Clicked / Encoder | LINE OUT | PHONES | SW 1 | SW 2 | POT 1 | POT 2
bPlace: (C) Electrosmith 2022 | Rev5 | H11L1 / SR2M | Headphone / Volume